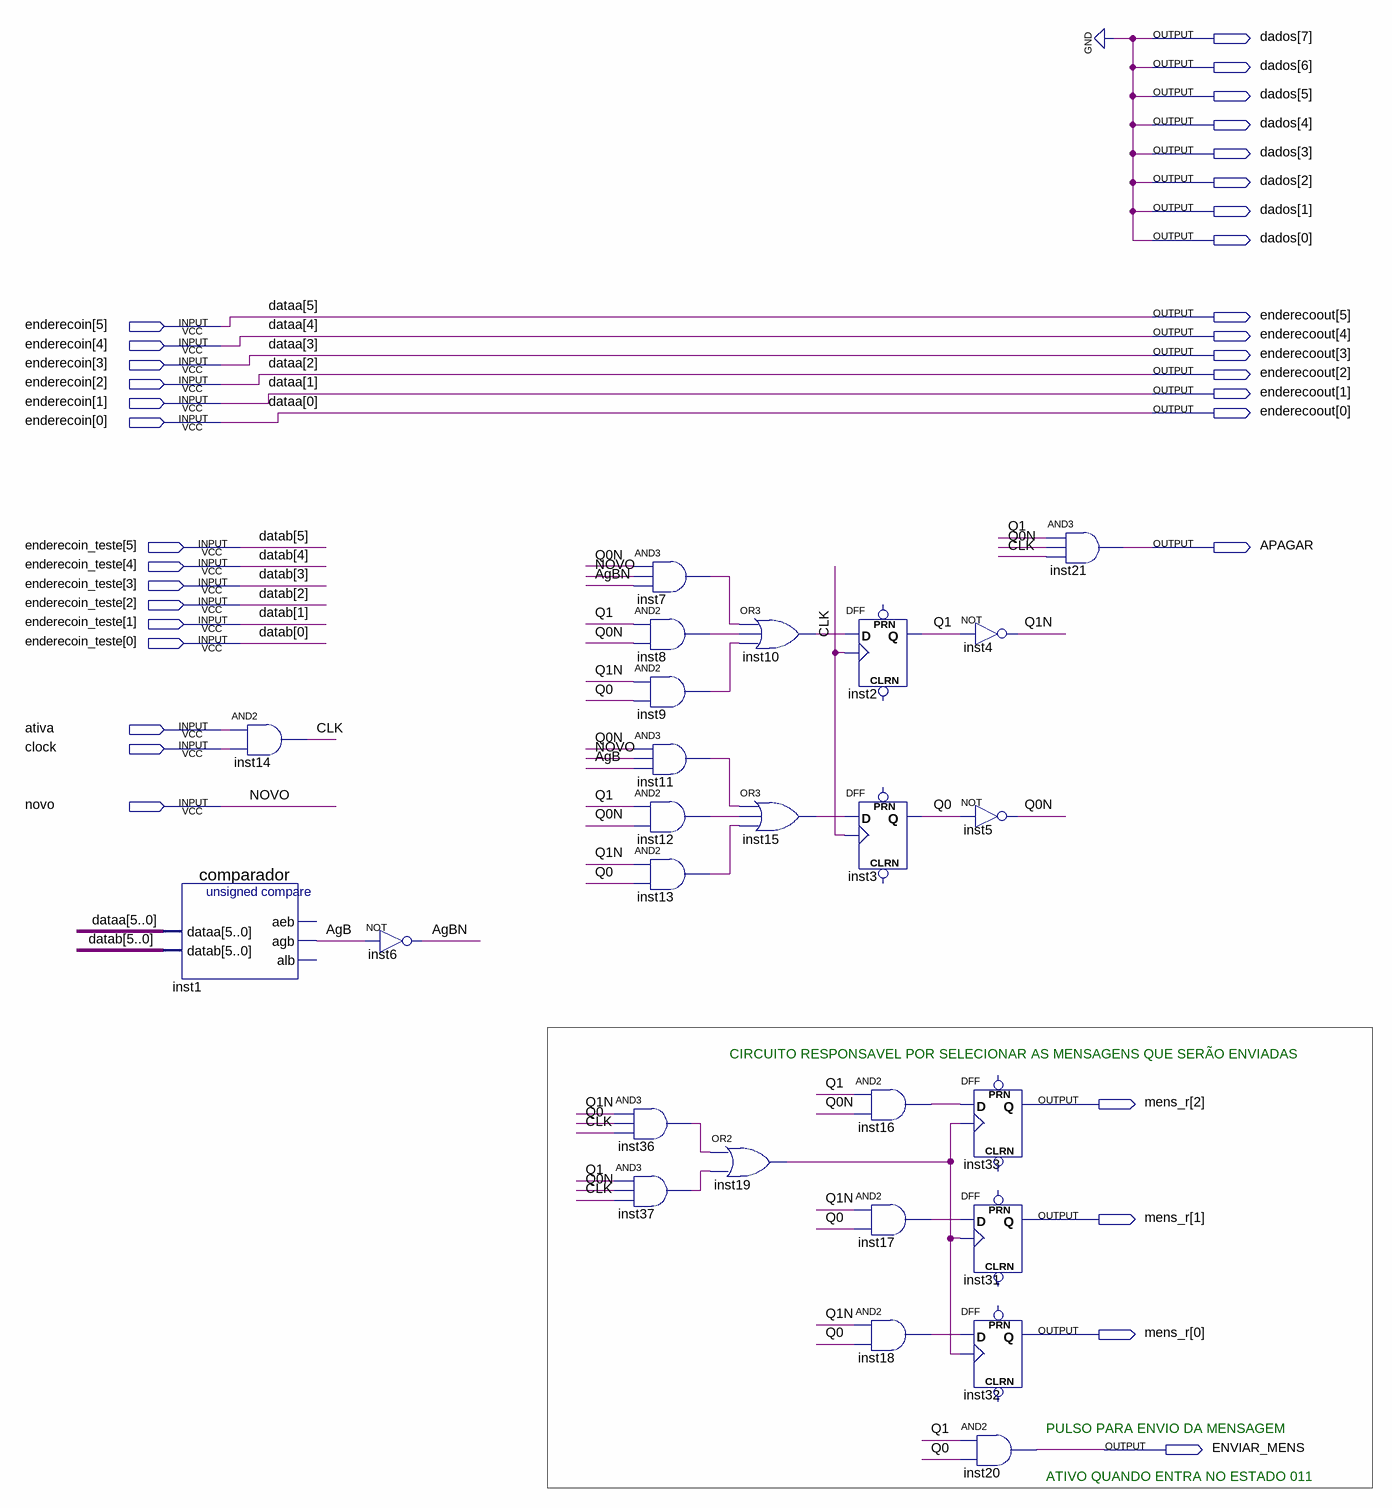
[diagram p0: schematic sheet]
// Quartus schematic mef_remocao.bdf as structural Verilog: 26 symbols, 34 pins
module mef_remocao (
  input  [5:0] enderecoin,
  input  [5:0] enderecoin_teste,
  input  ativa,
  input  clock,
  input  novo,
  output [7:0] dados,
  output [5:0] enderecoout,
  output APAGAR,
  output [2:0] mens_r,
  output ENVIAR_MENS
);

  wire AgB, AgBN, CLK, inst7_out, inst8_out, inst9_out, inst10_out, inst11_out, inst12_out, inst13_out,
       inst15_out, inst16_out, inst17_out, inst18_out, inst19_out, inst36_out, inst37_out, Q0, Q0N, Q1, Q1N;

  comparador inst1 (.dataa(enderecoin), .datab(enderecoin_teste), .agb(AgB));  // open: aeb, alb
  and inst14 (CLK, ativa, clock);
  not inst6 (AgBN, AgB);
  and inst7 (inst7_out, Q0N, novo, AgBN);
  and inst8 (inst8_out, Q1, Q0N);
  and inst9 (inst9_out, Q1N, Q0);
  and inst11 (inst11_out, Q0N, novo, AgB);
  and inst12 (inst12_out, Q1, Q0N);
  and inst13 (inst13_out, Q1N, Q0);
  and inst36 (inst36_out, Q1N, Q0, CLK);
  and inst37 (inst37_out, Q1, Q0N, CLK);
  or inst19 (inst19_out, inst36_out, inst37_out);
  or inst10 (inst10_out, inst7_out, inst8_out, inst9_out);
  or inst15 (inst15_out, inst11_out, inst12_out, inst13_out);
  DFF inst2 (.CLK(CLK), .D(inst10_out), .Q(Q1));  // open: CLRN, PRN
  DFF inst3 (.CLK(CLK), .D(inst15_out), .Q(Q0));  // open: CLRN, PRN
  and inst16 (inst16_out, Q1, Q0N);
  and inst17 (inst17_out, Q1N, Q0);
  and inst18 (inst18_out, Q1N, Q0);
  not inst4 (Q1N, Q1);
  not inst5 (Q0N, Q0);
  DFF inst33 (.CLK(inst19_out), .D(inst16_out), .Q(mens_r[2]));  // open: CLRN, PRN
  DFF inst31 (.CLK(inst19_out), .D(inst17_out), .Q(mens_r[1]));  // open: CLRN, PRN
  DFF inst32 (.CLK(inst19_out), .D(inst18_out), .Q(mens_r[0]));  // open: CLRN, PRN
  and inst20 (ENVIAR_MENS, Q1, Q0);
  and inst21 (APAGAR, Q1, Q0N, CLK);

  assign dados = {8{1'b0}};
  assign enderecoout = enderecoin;

  // Other names for the same wires on the sheet: datab[5:0] = enderecoin_teste; dataa[5:0] = enderecoin

  // Notes on the sheet:
  //   CIRCUITO RESPONSAVEL POR SELECIONAR AS MENSAGENS QUE SERÃO ENVIADAS
  //   PULSO PARA ENVIO DA MENSAGEM
  //   ATIVO QUANDO ENTRA NO ESTADO 011
endmodule
